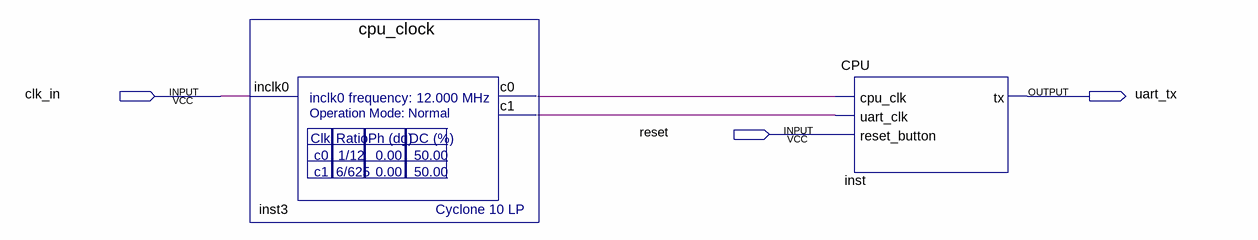
[diagram p0: schematic sheet]
// Quartus schematic riscv_core.bdf as structural Verilog: 2 symbols, 3 pins
module riscv_core (
  input  clk_in,
  input  reset,
  output uart_tx
);

  wire inst3_c0, inst3_c1;

  cpu_clock inst3 (.inclk0(clk_in), .c0(inst3_c0), .c1(inst3_c1));
  CPU inst (.cpu_clk(inst3_c0), .uart_clk(inst3_c1), .reset_button(reset), .tx(uart_tx));
endmodule
